# Altium schematic sheet GPIO.SchDoc
size A; SheetNumber: 6; SheetTotal: 7
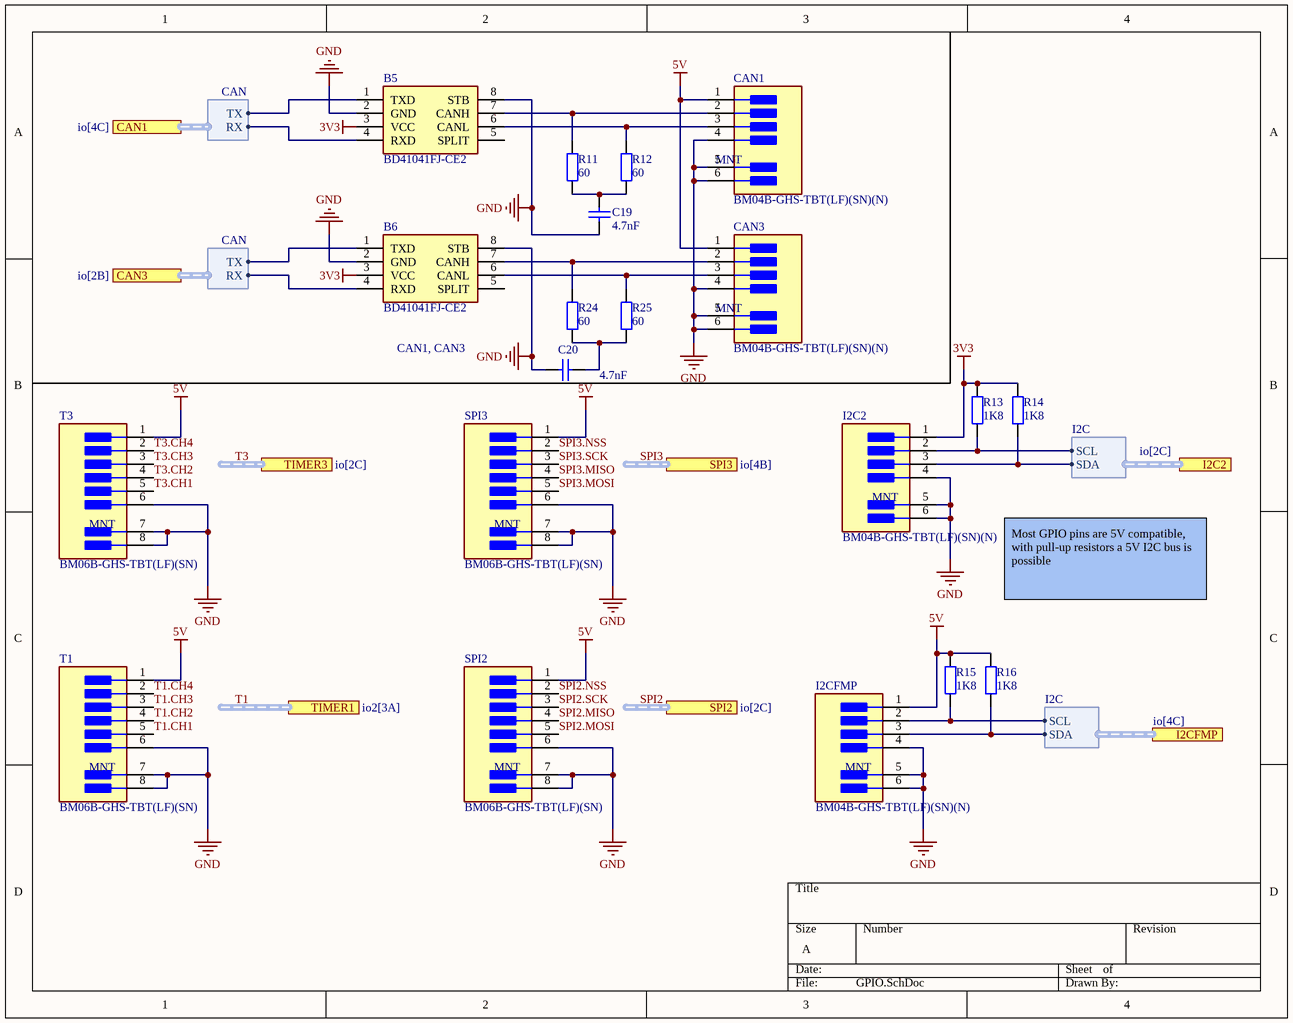
[diagram p0: GPIO.SchDoc]

## Parts
B5  BD41041FJ-CE2  [SOIC127P600X165-8N]
B6  BD41041FJ-CE2  [SOIC127P600X165-8N]
C19  4.7nF  [FP_0805_CAP_085]
C20  4.7nF  [FP_0805_CAP_085]
CAN1  BM04B-GHS-TBT(LF)(SN)(N)  [FP-SM04B-GHS-TB_LF_SN-MFG]
CAN3  BM04B-GHS-TBT(LF)(SN)(N)  [FP-SM04B-GHS-TB_LF_SN-MFG]
I2C2  BM04B-GHS-TBT(LF)(SN)(N)  [FP-BM04B-GHS-TBT_LF_SN-MFG]
I2CFMP  BM04B-GHS-TBT(LF)(SN)(N)  [FP-BM04B-GHS-TBT_LF_SN-MFG]
R11  60  [FP_0805_RES]
R12  60  [FP_0805_RES]
R13  1K8  [FP_0805_RES]
R14  1K8  [FP_0805_RES]
R15  1K8  [FP_0805_RES]
R16  1K8  [FP_0805_RES]
R24  60  [FP_0805_RES]
R25  60  [FP_0805_RES]
SPI2  BM06B-GHS-TBT(LF)(SN)  [FP-SM06B-GHS-TB_LF_SN-MFG]
SPI3  BM06B-GHS-TBT(LF)(SN)  [FP-SM06B-GHS-TB_LF_SN-MFG]
T1  BM06B-GHS-TBT(LF)(SN)  [FP-BM06B-GHS-TBT_LF_SN-MFG]
T3  BM06B-GHS-TBT(LF)(SN)  [FP-BM06B-GHS-TBT_LF_SN-MFG]

## Ports
CAN1 (harness CAN, see io[4C]), CAN3 (harness CAN, see io[2B]), I2C2 (harness I2C, see io[2C]), I2CFMP (harness I2C, see io[4C]), SPI2 (harness SPI, see io[2C]), SPI3 (harness SPI, see io[4B]), TIMER1 (harness TIMER, see io2[3A]), TIMER3 (harness TIMER, see io[2C])

## Harnesses
CAN: RX, TX
I2C: SCL, SDA

## Nets
3V3: B5.3(VCC) B6.3(VCC) I2C2.1 R13.2 R14.2
5V: CAN1.1 CAN3.1 I2CFMP.1 R15.2 R16.2 SPI2.1 SPI3.1 T1.1 T3.1
GND: B5.2(GND) B5.8(STB) B6.2(GND) B6.8(STB) C19.1 C20.2 CAN1.4 CAN1.5(MNT_1) CAN1.6(MNT_2) CAN3.4 CAN3.5(MNT_1) CAN3.6(MNT_2) I2C2.4 I2C2.5(MNT_1) I2C2.6(MNT_2) I2CFMP.4 I2CFMP.5(MNT_1) I2CFMP.6(MNT_2) SPI2.6 SPI2.7(MNT_1) SPI2.8(MNT_2) SPI3.6 SPI3.7(MNT_1) SPI3.8(MNT_2) T1.6 T1.7(MNT_1) T1.8(MNT_2) T3.6 T3.7(MNT_1) T3.8(MNT_2)
SPI2.MISO: SPI2.4
SPI2.MOSI: SPI2.5
SPI2.NSS: SPI2.2
SPI2.SCK: SPI2.3
SPI3.MISO: SPI3.4
SPI3.MOSI: SPI3.5
SPI3.NSS: SPI3.2
SPI3.SCK: SPI3.3
T1.CH1: T1.5
T1.CH2: T1.4
T1.CH3: T1.3
T1.CH4: T1.2
T3.CH1: T3.5
T3.CH2: T3.4
T3.CH3: T3.3
T3.CH4: T3.2
NetB5_1: B5.1(TXD) ; port CAN1.TX
NetB5_4: B5.4(RXD) ; port CAN1.RX
NetB5_6: B5.6(CANL) CAN1.3 R12.2
NetB5_7: B5.7(CANH) CAN1.2 R11.2
NetB6_1: B6.1(TXD) ; port CAN3.TX
NetB6_4: B6.4(RXD) ; port CAN3.RX
NetB6_6: B6.6(CANL) CAN3.3 R25.2
NetB6_7: B6.7(CANH) CAN3.2 R24.2
NetC19_2: C19.2 R11.1 R12.1
NetC20_1: C20.1 R24.1 R25.1
NetI2C2_2: I2C2.2 R13.1 ; port I2C2.SCL
NetI2C2_3: I2C2.3 R14.1 ; port I2C2.SDA
NetI2CFMP_2: I2CFMP.2 R15.1 ; port I2CFMP.SCL
NetI2CFMP_3: I2CFMP.3 R16.1 ; port I2CFMP.SDA

Not connected (* = marked no-connect by the designer): B5 5(SPLIT); B6 5(SPLIT)

## Buses and harness runs
harness SPI2 = port SPI2
harness SPI3 = port SPI3
harness T1 = port TIMER1
harness T3 = port TIMER3

## Notes on the sheet
- CAN1, CAN3
- Most GPIO pins are 5V compatible, with pull-up resistors a 5V I2C bus is possible
- (in symbol CMP-17439-000054-1) MNT
- (in symbol CMP-17439-000166-1) MNT

## Library data of the parts
B5 B6 = BD41041FJ-CE2: ROHM Semiconductor CAN Transceiver for Automotive; Geometry.Height: 1.65mm; Mouser Part Number: 755-BD41041FJ-CE2; Mouser Price/Stock: https://www.mouser.co.uk/ProductDetail/ROHM-Semiconductor/BD41041FJ-CE2?qs=%252BEew9%252B0nqrCizAYMbF4Vxg%3D%3D; Manufacturer_Name: ROHM Semiconductor; Manufacturer_Part_Number: BD41041FJ-CE2; Datasheet Link: https://datasheet.datasheetarchive.com/originals/distributors/Datasheets_SAMA/414644ee1dc91df04c2a44596c540576.pdf
C19 C20 = CAP: Capacitor; Value: 4.7nF
CAN1 CAN3 I2C2 I2CFMP = CMP-17439-000054-1: 4p; Number of Positions: 4; Pitch: 0.049inch; Connector Type: Outer Shroud Contact; Termination: Solder; Number of Pins: 4; Color: Natural; Number of Rows: 1; Lead Free: Lead Free; Mount: Surface Mount; Contact Plating: Tin; Packaging: Tape and Reel; Fastening Type: Ramp
R11-R16 R24 R25 = RES: Resistor
  R11 R12 R24 R25: Value: 60
  R13-R16: Value: 1K8
SPI2 SPI3 T1 T3 = CMP-17439-000166-1: 6p; Pitch: 1.25mm; Number of Contacts: 6; Current Rating: 1A; Voltage Rating: 50V; Housing Material: Nylon; Lead Free: Lead Free; Packaging: Cut Tape; Number of Rows: 1; Series: GH; Contact Material: Bronze; Orientation: Straight; Termination: Solder; Mount: Surface Mount; Housing Color: Natural; Number of Positions: 6